# Altium schematic sheet Nixie_Driver.SchDoc
size A4
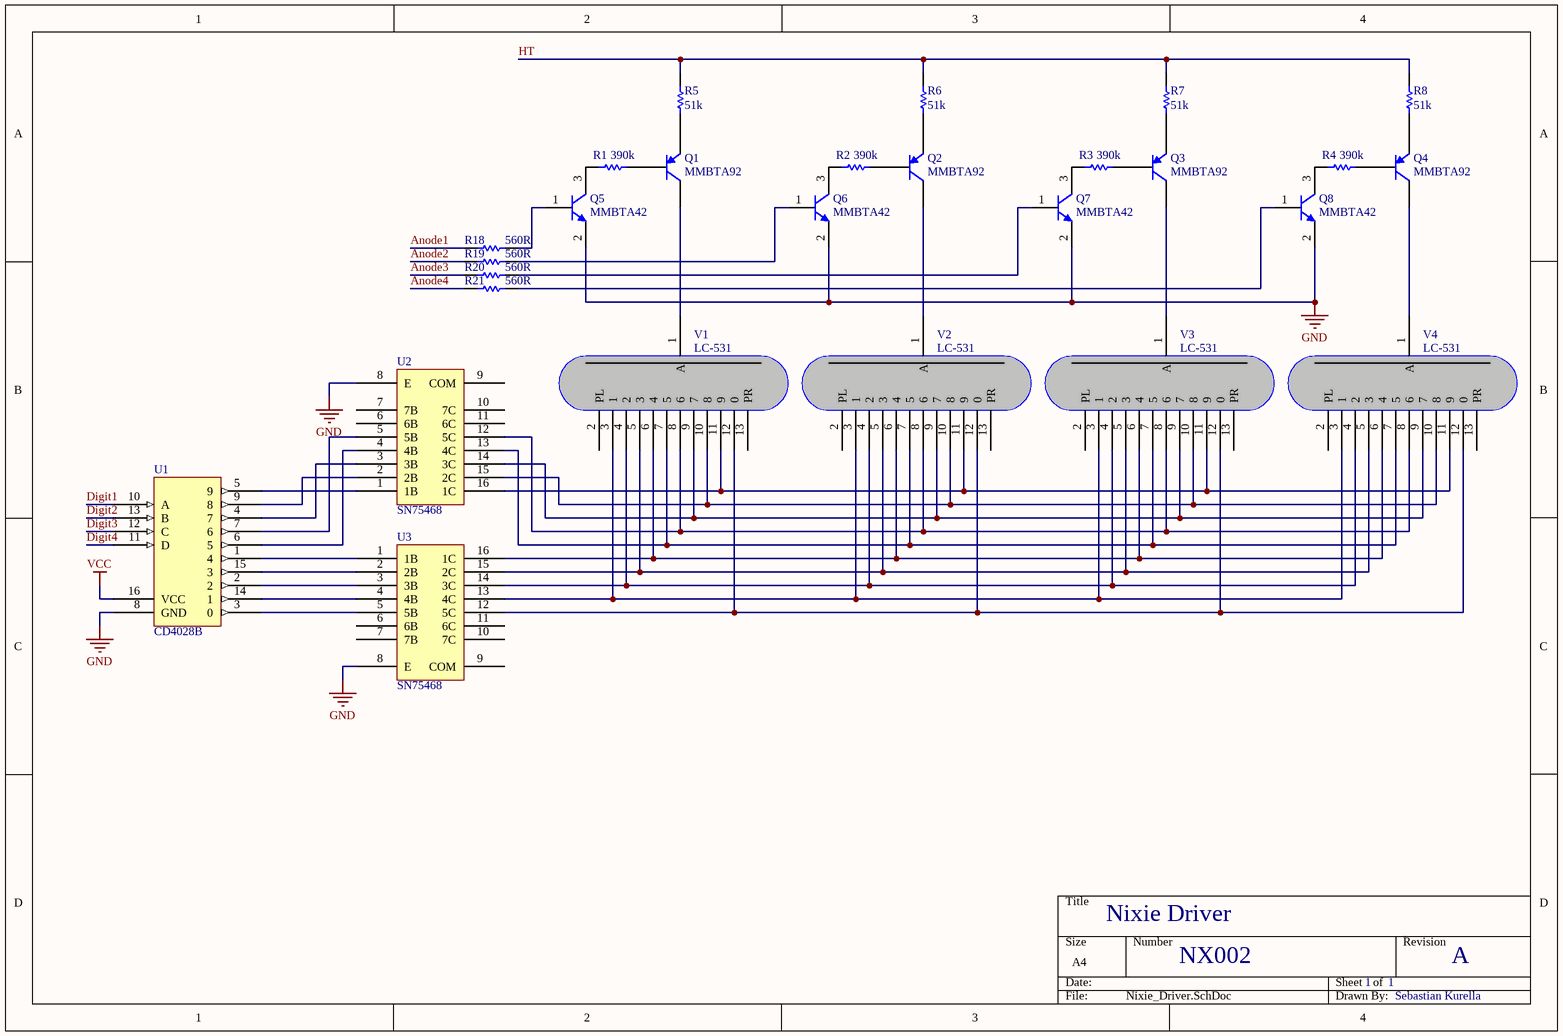
[diagram p0: Nixie_Driver.SchDoc]

## Parts
Q1  MMBTA92  [INF-SOT23_M]
Q2  MMBTA92  [INF-SOT23_M]
Q3  MMBTA92  [INF-SOT23_M]
Q4  MMBTA92  [INF-SOT23_M]
Q5  MMBTA42  [ONSC-SOT-23-3-318-08_V]
Q6  MMBTA42  [ONSC-SOT-23-3-318-08_V]
Q7  MMBTA42  [ONSC-SOT-23-3-318-08_V]
Q8  MMBTA42  [ONSC-SOT-23-3-318-08_V]
R1  value 390k  [RESC0805(2012)_M]  (hidden comment: 390K 5% 0805(2012))
R2  value 390k  [RESC0805(2012)_M]  (hidden comment: 390K 5% 0805(2012))
R3  value 390k  [RESC0805(2012)_M]  (hidden comment: 390K 5% 0805(2012))
R4  value 390k  [RESC0805(2012)_M]  (hidden comment: 390K 5% 0805(2012))
R5  value 51k  [RESC0805(2012)_M]  (hidden comment: 51K 5% 0805(2012))
R6  value 51k  [RESC0805(2012)_M]  (hidden comment: 51K 5% 0805(2012))
R7  value 51k  [RESC0805(2012)_M]  (hidden comment: 51K 5% 0805(2012))
R8  value 51k  [RESC0805(2012)_M]  (hidden comment: 51K 5% 0805(2012))
R18  560R  [RESC0805(2012)_M]
R19  560R  [RESC0805(2012)_M]
R20  560R  [RESC0805(2012)_M]
R21  560R  [RESC0805(2012)_M]
U1  CD4028B  [CD4028B]
U2  SN75468  [SN7546x]
U3  SN75468  [SN7546x]
V1  LC-531  [LC-531]
V2  LC-531  [LC-531]
V3  LC-531  [LC-531]
V4  LC-531  [LC-531]

## Nets
GND: Q5.2(E) Q6.2(E) Q7.2(E) Q8.2(E) U1.8(GND) U2.8(E) U3.8(E)
VCC: U1.16(VCC)
Anode1: R18.1
Anode2: R19.1
Anode3: R20.1
Anode4: R21.1
Digit1: U1.10(A)
Digit2: U1.13(B)
Digit3: U1.12(C)
Digit4: U1.11(D)
HT: R5.2 R6.2 R7.2 R8.2
NetQ1_1: Q1.1(B) R1.2
NetQ1_2: Q1.2(E) R5.1
NetQ1_3: Q1.3(C) V1.1(A)
NetQ2_1: Q2.1(B) R2.2
NetQ2_2: Q2.2(E) R6.1
NetQ2_3: Q2.3(C) V2.1(A)
NetQ3_1: Q3.1(B) R3.2
NetQ3_2: Q3.2(E) R7.1
NetQ3_3: Q3.3(C) V3.1(A)
NetQ4_1: Q4.1(B) R4.2
NetQ4_2: Q4.2(E) R8.1
NetQ4_3: Q4.3(C) V4.1(A)
NetQ5_1: Q5.1(B) R18.2
NetQ5_3: Q5.3(C) R1.1
NetQ6_1: Q6.1(B) R19.2
NetQ6_3: Q6.3(C) R2.1
NetQ7_1: Q7.1(B) R20.2
NetQ7_3: Q7.3(C) R3.1
NetQ8_1: Q8.1(B) R21.2
NetQ8_3: Q8.3(C) R4.1
NetU1_1: U1.1(4) U3.1(1B)
NetU1_2: U1.2 U3.3(3B)
NetU1_3: U1.3(0) U3.5(5B)
NetU1_4: U1.4(7) U2.3(3B)
NetU1_5: U1.5(9) U2.1(1B)
NetU1_6: U1.6(5) U2.4(4B)
NetU1_7: U1.7(6) U2.5(5B)
NetU1_9: U1.9(8) U2.2(2B)
NetU1_14: U1.14(1) U3.4(4B)
NetU1_15: U1.15(3) U3.2(2B)
NetU2_12: U2.12(5C) V1.8(6) V2.8(6) V3.8(6) V4.8(6)
NetU2_13: U2.13(4C) V1.7(5) V2.7(5) V3.7(5) V4.7(5)
NetU2_14: U2.14(3C) V1.9(7) V2.9(7) V3.9(7) V4.9(7)
NetU2_15: U2.15(2C) V1.10(8) V2.10(8) V3.10(8) V4.10(8)
NetU2_16: U2.16(1C) V1.11(9) V2.11(9) V3.11(9) V4.11(9)
NetU3_12: U3.12(5C) V1.12(0) V2.12(0) V3.12(0) V4.12(0)
NetU3_13: U3.13(4C) V1.3(1) V2.3(1) V3.3(1) V4.3(1)
NetU3_14: U3.14(3C) V1.4(2) V2.4(2) V3.4(2) V4.4(2)
NetU3_15: U3.15(2C) V1.5(3) V2.5(3) V3.5(3) V4.5(3)
NetU3_16: U3.16(1C) V1.6(4) V2.6(4) V3.6(4) V4.6(4)

Not connected (* = marked no-connect by the designer): U2 6(6B) 7(7B) 9(COM) 10(7C) 11(6C); U3 6(6B) 7(7B) 9(COM) 10(7C) 11(6C); V1 2(PL) 13(PR); V2 2(PL) 13(PR); V3 2(PL) 13(PR); V4 2(PL) 13(PR)

## Notes on the sheet
- Nixie Driver
- NX002
- 1
- A
- Sebastian Kurella

## Library data of the parts
Q1-Q4 = CMP-1197-00010-1: PNP Silicon High-Voltage Transistor, 300 V VCEO, 500 mA IC, SOT23, Reel, Green; Manufacturer: Infineon; hFE (min): 40; ICBO (max): 100 nA; Green: TRUE; VCE (max): 10 V; fT (typ): 50 MHz; IC (max): 500 mA; VEBO (max): 5 V; VCEO (max): 300 V; IC: 30 mA; ComponentLink3Description: Package Specification; ComponentLink2URL: http://www.infineon.com/dgdl/smbta92-mmbta92.pdf?folderId=db3a30431441fb5d011449af3ad90232&fileId=db3a30431441fb5d011449c5cd03023b; PartNumber: MMBTA92; ComponentLink1Description: Manufacturer URL; PackageReference: SOT23; Packing: Reel; ComponentLink3URL: http://www.infineon.com/dgdl/SOT23-Package_Overview.pdf?folderId=db3a30431936bc4b0119532290053c66&fileId=db3a30431936bc4b0119533468123c85; PackageVersion: Apr-08; PackageDescription: 3-Pin Small Outline Transistor Package, 1.3 x 2.9 mm Body, 0.95 mm Pitch; ComponentLink1URL: http://www.infineon.com/; Polarity: PNP; VCE: 10 V; Mounting Technology: Surface Mount; ComponentLink2Description: Datasheet; VCBO (max): 300 V
Q5-Q8 = CMP-1048-00662-1: High Voltage Transistor, NPN Silicon, 3-Pin SOT-23, Pb-Free, Tape and Reel; Manufacturer: On Semiconductor; fT Min (MHz): 50; IC Continuous (A): 0.5; ComponentLink1URL: http://www.onsemi.com/; ComponentLink3URL: http://www.onsemi.cn/pub_link/Collateral/318-08.PDF; RoHS: TRUE; ComponentLink2Description: Datasheet; PartNumber: MMBTA42; Polarity: NPN; DatasheetVersion: Rev. 12; PackageReference: SOT-23-3-318-08; PackageDescription: 3-Pin Small Outline Transistor, Body 2.92 x 1.3 mm, Pitch 0.95 mm; ComponentLink3Description: Package Specification; ComponentLink1Description: Manufacturer URL; Packing: Tape and Reel; PackageVersion: Rev. AP, 11/2009; Mounting Technology: Surface Mount; ComponentLink2URL: http://www.onsemi.cn/pub_link/Collateral/MMBTA42LT1-D.PDF
R1-R4 = CMP-1013-00136-1: 390K 0.125W 5% 0805 (2012 Metric)  SMD; Case-EIA: 0805; Case-Metric: 2012; Tolerance: 5 %; Power: 0.125 W; Technology: SMT
R5-R8 = CMP-1013-00115-1: 51K 0.125W 5% 0805 (2012 Metric)  SMD; Case-Metric: 2012; Case-EIA: 0805; Technology: SMT; Power: 0.125 W; Tolerance: 5 %
R18-R21 = CMP-1013-00068-1: 560R 0.125W 5% 0805 (2012 Metric)  SMD; Case-Metric: 2012; Value: 560.00 Ohm; Case-EIA: 0805; Power: 0.125 W; Technology: SMT; Tolerance: 5 %
U1 = CD4028B: BCD-to-decimal driver
U2 U3 = SN7546x: Darlington Transistor Array
V1-V4 = LC531: Nixie tube